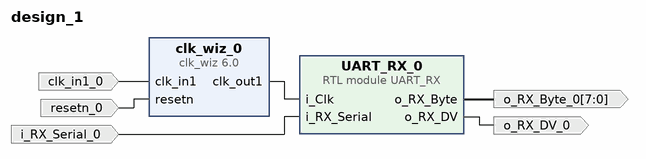
[diagram p0: block diagram of the top level]
# Vivado block design design_1, xc7z010clg400-1, Vivado 2019.1
create_bd_design design_1

create_bd_port -dir I -type clk clk_in1_0
set_property -dict {CONFIG.FREQ_HZ 33333300} [get_bd_ports clk_in1_0]
create_bd_port -dir I -type rst resetn_0
create_bd_port -dir I i_RX_Serial_0
create_bd_port -dir O o_RX_DV_0
create_bd_port -dir O -from 7 -to 0 o_RX_Byte_0

create_bd_cell -type ip -vlnv xilinx.com:ip:clk_wiz:6.0 clk_wiz_0
set_property -dict [list \
  CONFIG.CLKIN1_JITTER_PS 300.0 \
  CONFIG.CLKOUT1_JITTER 396.922 \
  CONFIG.CLKOUT1_PHASE_ERROR 204.117 \
  CONFIG.CLKOUT1_REQUESTED_OUT_FREQ 10.000 \
  CONFIG.MMCM_CLKFBOUT_MULT_F 30.000 \
  CONFIG.MMCM_CLKIN1_PERIOD 30.000 \
  CONFIG.MMCM_CLKIN2_PERIOD 10.0 \
  CONFIG.MMCM_CLKOUT0_DIVIDE_F 100.000 \
  CONFIG.PRIM_IN_FREQ 33.3333 \
  CONFIG.RESET_PORT resetn \
  CONFIG.RESET_TYPE ACTIVE_LOW \
  CONFIG.USE_LOCKED false \
] [get_bd_cells clk_wiz_0]
create_bd_cell -type module -reference UART_RX UART_RX_0

# ---- connections ----

connect_bd_net -net clk_in1_0_1 [get_bd_ports clk_in1_0] [get_bd_pins clk_wiz_0/clk_in1]
connect_bd_net -net resetn_0_1 [get_bd_ports resetn_0] [get_bd_pins clk_wiz_0/resetn]
connect_bd_net -net i_RX_Serial_0_1 [get_bd_ports i_RX_Serial_0] [get_bd_pins UART_RX_0/i_RX_Serial]
connect_bd_net [get_bd_pins UART_RX_0/o_RX_DV] [get_bd_ports o_RX_DV_0]
connect_bd_net [get_bd_pins UART_RX_0/o_RX_Byte] [get_bd_ports o_RX_Byte_0]
connect_bd_net [get_bd_pins clk_wiz_0/clk_out1] [get_bd_pins UART_RX_0/i_Clk]

validate_bd_design
save_bd_design
